# Altium schematic sheet Opamps.SchDoc
size A4; Author: Thomas Kreppel; CompanyName: Universidad de Santiago de Chile; Address1: Avenida Ecuador Nº 3519; Address2: Estación Central, Santiago; Address3: Chile; DocumentNumber: 4; SheetNumber: 4; SheetTotal: 6
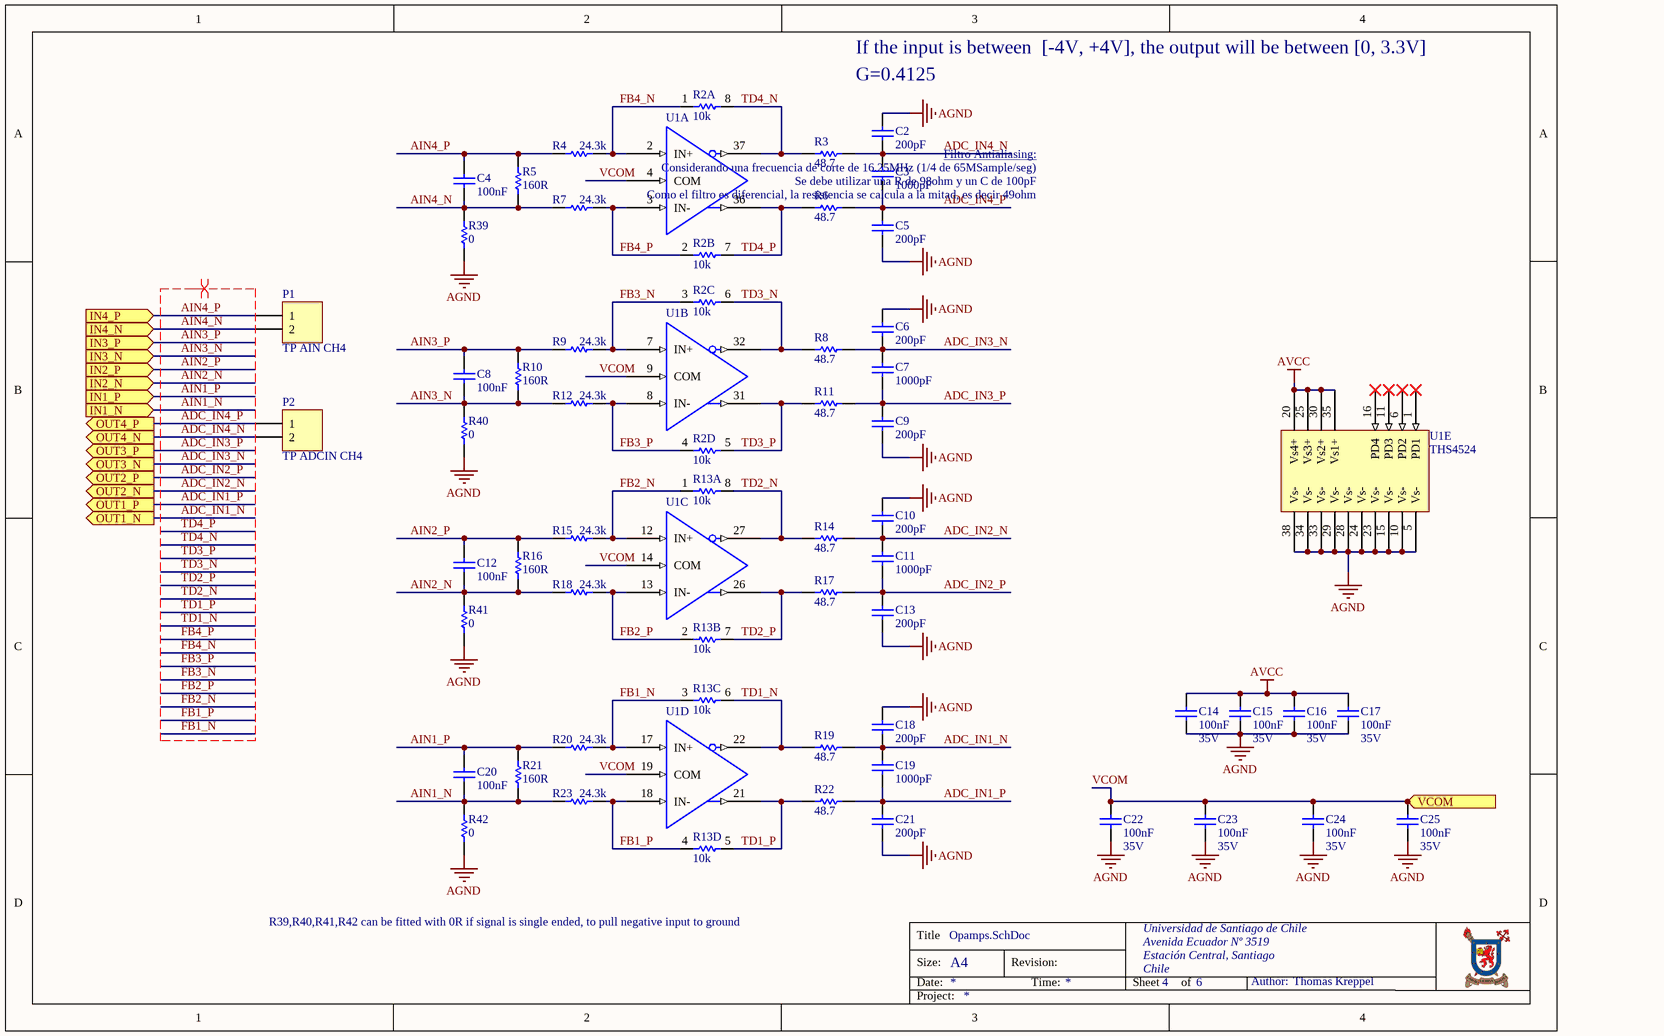
[diagram p0: Opamps.SchDoc]

## Parts
C2  200pF  [CAP_0603]
C3  1000pF  [CAP_0603]
C4  100nF  [RES_1206]
C5  200pF  [CAP_0603]
C6  200pF  [CAP_0603]
C7  1000pF  [CAP_0603]
C8  100nF  [RES_1206]
C9  200pF  [CAP_0603]
C10  200pF  [CAP_0603]
C11  1000pF  [CAP_0603]
C12  100nF  [RES_1206]
C13  200pF  [CAP_0603]
C14  100nF  Voltage: 35V  [CAP_0603]
C15  100nF  Voltage: 35V  [CAP_0603]
C16  100nF  Voltage: 35V  [CAP_0603]
C17  100nF  Voltage: 35V  [CAP_0603]
C18  200pF  [CAP_0603]
C19  1000pF  [CAP_0603]
C20  100nF  [RES_1206]
C21  200pF  [CAP_0603]
C22  100nF  Voltage: 35V  [CAP_0603]
C23  100nF  Voltage: 35V  [CAP_0603]
C24  100nF  Voltage: 35V  [CAP_0603]
C25  100nF  Voltage: 35V  [CAP_0603]
P1  TP AIN CH4  [HDR1X2]  (no BOM)
P2  TP ADCIN CH4  [HDR1X2]  (no BOM)
R2  10k  [CAC-80P320X160-8N]  (parts A,B,C,D of 4)
R3  48.7  [RES_0603]
R4  24.3k  [RES_0603]
R5  160R  [RES_1206]
R6  48.7  [RES_0603]
R7  24.3k  [RES_0603]
R8  48.7  [RES_0603]
R9  24.3k  [RES_0603]
R10  160R  [RES_1206]
R11  48.7  [RES_0603]
R12  24.3k  [RES_0603]
R13  10k  [CAC-80P320X160-8N]  (parts A,B,C,D of 4)
R14  48.7  [RES_0603]
R15  24.3k  [RES_0603]
R16  160R  [RES_1206]
R17  48.7  [RES_0603]
R18  24.3k  [RES_0603]
R19  48.7  [RES_0603]
R20  24.3k  [RES_0603]
R21  160R  [RES_1206]
R22  48.7  [RES_0603]
R23  24.3k  [RES_0603]
R39  0  [RES_0603]
R40  0  [RES_0603]
R41  0  [RES_0603]
R42  0  [RES_0603]
U1  THS4524  [THS4524 Footprint]  (value not drawn)  (parts A,B,C,D,E of 5)

## Ports
IN1_N (in), IN1_P (in), IN2_N (in), IN2_P (in), IN3_N (in), IN3_P (in), IN4_N (in), IN4_P (in), OUT1_N (out), OUT1_P (out), OUT2_N (out), OUT2_P (out), OUT3_N (out), OUT3_P (out), OUT4_N (out), OUT4_P (out), VCOM (in)

## Nets
AGND: C2.1 C5.2 C6.1 C9.2 C10.1 C13.2 C14.2 C15.2 C16.2 C17.2 C18.1 C21.2 C22.1 C23.1 C24.1 C25.1 R39.2 R40.2 R41.2 R42.2 U1.5(Vs-) U1.10(Vs-) U1.15(Vs-) U1.23(Vs-) U1.24(Vs-) U1.28(Vs-) U1.29(Vs-) U1.33(Vs-) U1.34(Vs-) U1.38(Vs-)
AVCC: C14.1 C15.1 C16.1 C17.1 U1.20(Vs4+) U1.25(Vs3+) U1.30(Vs2+) U1.35(Vs1+)
ADC_IN1_N: C18.2 C19.1 R19.1 ; port OUT1_N
ADC_IN1_P: C19.2 C21.1 R22.1 ; port OUT1_P
ADC_IN2_N: C10.2 C11.1 R14.1 ; port OUT2_N
ADC_IN2_P: C11.2 C13.1 R17.1 ; port OUT2_P
ADC_IN3_N: C6.2 C7.1 R8.1 ; port OUT3_N
ADC_IN3_P: C7.2 C9.1 R11.1 ; port OUT3_P
ADC_IN4_N: C2.2 C3.1 P2.2 R3.1 ; port OUT4_N
ADC_IN4_P: C3.2 C5.1 P2.1 R6.1 ; port OUT4_P
AIN1_N: C20.2 R21.2 R23.2 R42.1 ; port IN1_N
AIN1_P: C20.1 R20.2 R21.1 ; port IN1_P
AIN2_N: C12.2 R16.2 R18.2 R41.1 ; port IN2_N
AIN2_P: C12.1 R15.2 R16.1 ; port IN2_P
AIN3_N: C8.2 R10.2 R12.2 R40.1 ; port IN3_N
AIN3_P: C8.1 R9.2 R10.1 ; port IN3_P
AIN4_N: C4.2 P1.2 R5.2 R7.2 R39.1 ; port IN4_N
AIN4_P: C4.1 P1.1 R4.2 R5.1 ; port IN4_P
FB1_N: R13.3 R20.1 U1.17(IN+)
FB1_P: R13.4 R23.1 U1.18(IN-)
FB2_N: R13.1 R15.1 U1.12(IN+)
FB2_P: R13.2 R18.1 U1.13(IN-)
FB3_N: R2.3 R9.1 U1.7(IN+)
FB3_P: R2.4 R12.1 U1.8(IN-)
FB4_N: R2.1 R4.1 U1.2(IN+)
FB4_P: R2.2 R7.1 U1.3(IN-)
TD1_N: R13.6 R19.2 U1.22(OUT-)
TD1_P: R13.5 R22.2 U1.21(OUT+)
TD2_N: R13.8 R14.2 U1.27(OUT-)
TD2_P: R13.7 R17.2 U1.26(OUT+)
TD3_N: R2.6 R8.2 U1.32(OUT-)
TD3_P: R2.5 R11.2 U1.31(OUT+)
TD4_N: R2.8 R3.2 U1.37(OUT-)
TD4_P: R2.7 R6.2 U1.36(OUT+)
VCOM: C22.2 C23.2 C24.2 C25.2 U1.4(COM) U1.9(COM) U1.14(COM) U1.19(COM) ; port VCOM

Not connected (* = marked no-connect by the designer): U1 1(PD1)* 6(PD2)* 11(PD3)* 16(PD4)*

## Layout directives
differential pair: ADC_IN1_N, ADC_IN1_P, ADC_IN2_N, ADC_IN2_P, ADC_IN3_N, ADC_IN3_P, ADC_IN4_N, ADC_IN4_P, AIN1_N, AIN1_P, AIN2_N, AIN2_P, AIN3_N, AIN3_P, AIN4_N, AIN4_P, FB1_N, FB1_P, FB2_N, FB2_P, FB3_N, FB3_P, FB4_N, FB4_P, TD1_N, TD1_P, TD2_N, TD2_P, TD3_N, TD3_P, TD4_N, TD4_P

## Notes on the sheet
- (near C2) G=0.4125
- If the input is between  [-4V, +4V], the output will be between [0, 3.3V]
- Considerando una frecuencia de corte de 16.25MHz (1/4 de 65MSample/seg)
- Se debe utilizar una R de 98ohm y un C de 100pF
- Filtro Antialiasing:
- Como el filtro es diferencial, la resistencia se calcula a la mitad, es decir 49ohm
- R39,R40,R41,R42 can be fitted with 0R if signal is single ended, to pull negative input to ground
- Title
- Size:
- Date:
- A4
- Revision:
- Time:
- Sheet
- of
- Author:
- Project:

## Library data of the parts
C2 C5 C6 C9 C10 C13 C18 C21 = Cap_0603: Capacitor; MPN: 0603N201J500CT; Rule: PcbType=ProtelPcb; MF: Walsin; Voltage: 16V; Dielectricum: CG0; Tolerance: 5%; Published: 8-Jun-2000; LatestRevisionDate: 17-Jul-2002; LatestRevisionNote: Re-released for DXP Platform.; PackageReference: RAD-0.3; Publisher: Altium Limited; Value: 200pF; Supplier Part Number 1: 1292-1499-1-ND; Supplier 1: Digikey; Package: 0603; LCSC Part Number: C458897
C3 C7 C11 C19 = Cap_0603: Capacitor; MPN: 885012006029; Rule: PcbType=ProtelPcb; MF: Würth Elektronik; Voltage: 16V; Dielectricum: CG0; Tolerance: 5%; Published: 8-Jun-2000; LatestRevisionDate: 17-Jul-2002; LatestRevisionNote: Re-released for DXP Platform.; PackageReference: RAD-0.3; Publisher: Altium Limited; Value: 1000pF; Supplier Part Number 1: 732-7771-1-ND; Supplier 1: Digikey; Package: 0603; LCSC Part Number: C6715067
C4 C8 C12 C20 = Cap_1206: Capacitor; MPN: C1206C104K3RACTU; Voltage: 16V; MF: KEMET; Dielectricum: X7R; Tolerance: 10%; Supplier Part Number 1: 399-8140-1-ND; Value: 100nF; Supplier 1: Digikey; Package: 1206; LCSC Part Number: C2168906
C14-C17 C22-C25 = Cap_0603: Capacitor; MPN: C0603C104M5RACTU; Rule: PcbType=ProtelPcb; MF: KEMET; Dielectricum: X7R; Tolerance: 10%; Published: 8-Jun-2000; LatestRevisionDate: 17-Jul-2002; LatestRevisionNote: Re-released for DXP Platform.; PackageReference: RAD-0.3; Publisher: Altium Limited; Value: 100nF; Supplier Part Number 1: 399-7845-1-ND; Supplier 1: Digikey; Package: 0603; LCSC Part Number: C14663
P1 P2 = Header 2: Header, 2-Pin; LatestRevisionDate: 17-Jul-2002; LatestRevisionNote: Re-released for DXP Platform.; Publisher: Altium Limited
R2 R13 = ResArray 1206: Chip Resistor Array 0606, 4xR; MPN: ACASA1002S1002P100; MF: Vishay; Value: 10k; Created: Kreppel_0420; Supplier 1: Digikey; Supplier Part Number 1: 749-1023-1-ND; LCSC Part Number: C2654165
R3 R6 R8 R11 R14 R17 R19 R22 = Res0603: MPN: ERA-3AEB48R7V; MF: Panasonic; Tolerance: 0.1%; Published: 8-Jun-2000; LatestRevisionDate: 17-Jul-2002; LatestRevisionNote: Re-released for DXP Platform.; PackageReference: AXIAL-0.3; Publisher: Altium Limited; PackageDescription: Axial Device, Thru-Hole; 2 Leads; 0.3 in Pin Spacing; Supplier Part Number 1: P48.7DBCT-ND; Value: 48.7; Supplier 1: Digikey; Package: 0603; LCSC Part Number: C3951932
R4 R7 R9 R12 R15 R18 R20 R23 = Res0603: MPN: ERJ-PB3B2432V; MF: Panasonic; Tolerance: 0.1%; Published: 8-Jun-2000; LatestRevisionDate: 17-Jul-2002; LatestRevisionNote: Re-released for DXP Platform.; PackageReference: AXIAL-0.3; Publisher: Altium Limited; PackageDescription: Axial Device, Thru-Hole; 2 Leads; 0.3 in Pin Spacing; Supplier Part Number 1: P20128CT-ND; Value: 24.3k; Supplier 1: Digikey; Package: 0603; LCSC Part Number: C2087018
R5 R10 R16 R21 = Res Semi: Limiter Resistor; MPN: RT1206BRD07160RL; MF: Yageo; Tolerance: 0.1%; Published: 8-Jun-2000; LatestRevisionDate: 17-Jul-2002; LatestRevisionNote: Re-released for DXP Platform.; PackageReference: AXIAL-0.5; Publisher: Altium Limited; PackageDescription: Axial Device, Thru-Hole; 2 Leads; 0.5 in Pin Spacing; Value: 160R; Supplier Part Number 1: YAG2013CT-ND; Supplier 1: Digikey; Package: 1206; LCSC Part Number: C870442
R39-R42 = Res0603: MPN: RC0603JR-070RL; MF: Yageo; Tolerance: 1%; Published: 8-Jun-2000; LatestRevisionDate: 17-Jul-2002; LatestRevisionNote: Re-released for DXP Platform.; PackageReference: AXIAL-0.3; Publisher: Altium Limited; PackageDescription: Axial Device, Thru-Hole; 2 Leads; 0.3 in Pin Spacing; Value: 0; Supplier 1: Digikey; Supplier 2: Mouser; Supplier Part Number 1: 311-0.0GRCT-ND; Package: 0603
U1 = THS4524_1: Quad Channel fully differential Amplilfier; MF: Texas Instruments; Created: 20190720_Kreppel; MPN: THS4524; Package: TSSOP-38; Supplier 1: Digikey; Supplier Part Number 1: 296-24315-1-ND; LCSC Part Number: C2057434